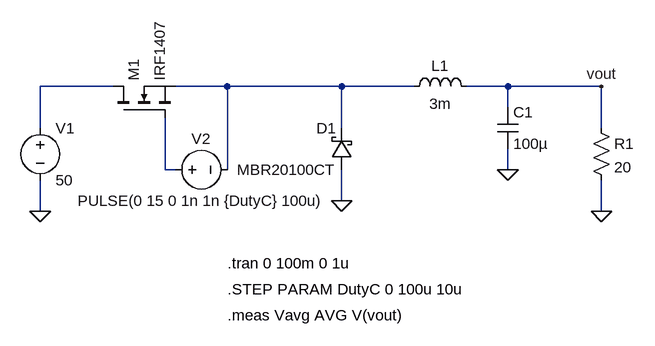
[diagram p0: schematic 01-buckConverter.asc]
01-buckConverter.asc, the LTspice schematic file:
Version 4
SHEET 1 976 680
WIRE 64 64 -48 64
WIRE 240 64 160 64
WIRE 416 64 240 64
WIRE 528 64 416 64
WIRE 672 64 608 64
WIRE 816 64 672 64
WIRE 672 96 672 64
WIRE -48 128 -48 64
WIRE 416 128 416 64
WIRE 816 128 816 64
WIRE 144 192 144 112
WIRE 160 192 144 192
WIRE 240 192 240 64
WIRE 672 192 672 160
WIRE 416 240 416 192
WIRE -48 256 -48 208
WIRE 816 256 816 208
FLAG 416 240 0
FLAG 672 192 0
FLAG 816 256 0
FLAG -48 256 0
FLAG 816 64 vout
SYMBOL schottky 432 192 R180
WINDOW 0 24 64 Left 2
WINDOW 3 24 0 Left 2
SYMATTR InstName D1
SYMATTR Value MBR20100CT
SYMATTR Description Diode
SYMATTR Type diode
SYMBOL voltage -48 112 R0
WINDOW 123 0 0 Left 0
WINDOW 39 0 0 Left 0
SYMATTR InstName V1
SYMATTR Value 50
SYMBOL ind 512 80 R270
WINDOW 0 32 56 VTop 2
WINDOW 3 5 56 VBottom 2
SYMATTR InstName L1
SYMATTR Value 3m
SYMBOL cap 656 96 R0
SYMATTR InstName C1
SYMATTR Value 100µ
SYMBOL res 800 112 R0
SYMATTR InstName R1
SYMATTR Value 20
SYMBOL nmos 64 112 R270
SYMATTR InstName M1
SYMATTR Value IRF1407
SYMBOL voltage 144 192 R270
WINDOW 0 32 56 VTop 2
WINDOW 3 -32 56 VBottom 2
WINDOW 123 0 0 Left 0
WINDOW 39 0 0 Left 0
SYMATTR InstName V2
SYMATTR Value PULSE(0 15 0 1n 1n {DutyC} 100u)
TEXT 240 336 Left 2 !.tran 0 100m 0 1u
TEXT 240 376 Left 2 !.STEP PARAM DutyC 0 100u 10u
TEXT 240 416 Left 2 !.meas Vavg AVG V(vout)

The netlist it stands for:
* 01-buckConverter.asc
D1 0 N002 MBR20100CT
V1 N001 0 50
L1 N002 vout 3m
C1 vout 0 100µ
R1 vout 0 20
M1 N001 N003 N002 N002 IRF1407
V2 N003 N002 PULSE(0 15 0 1n 1n {DutyC} 100u)
.model D D
.lib standard.dio
.model NMOS NMOS
.model PMOS PMOS
.lib standard.mos
.tran 0 100m 0 1u
.STEP PARAM DutyC 0 100u 10u
.meas Vavg AVG V(vout)
.backanno
.end